# EAGLE board 20200724_Main_Board_V2_ForOrdering (EAGLE 7.7.0), part 1 of 3
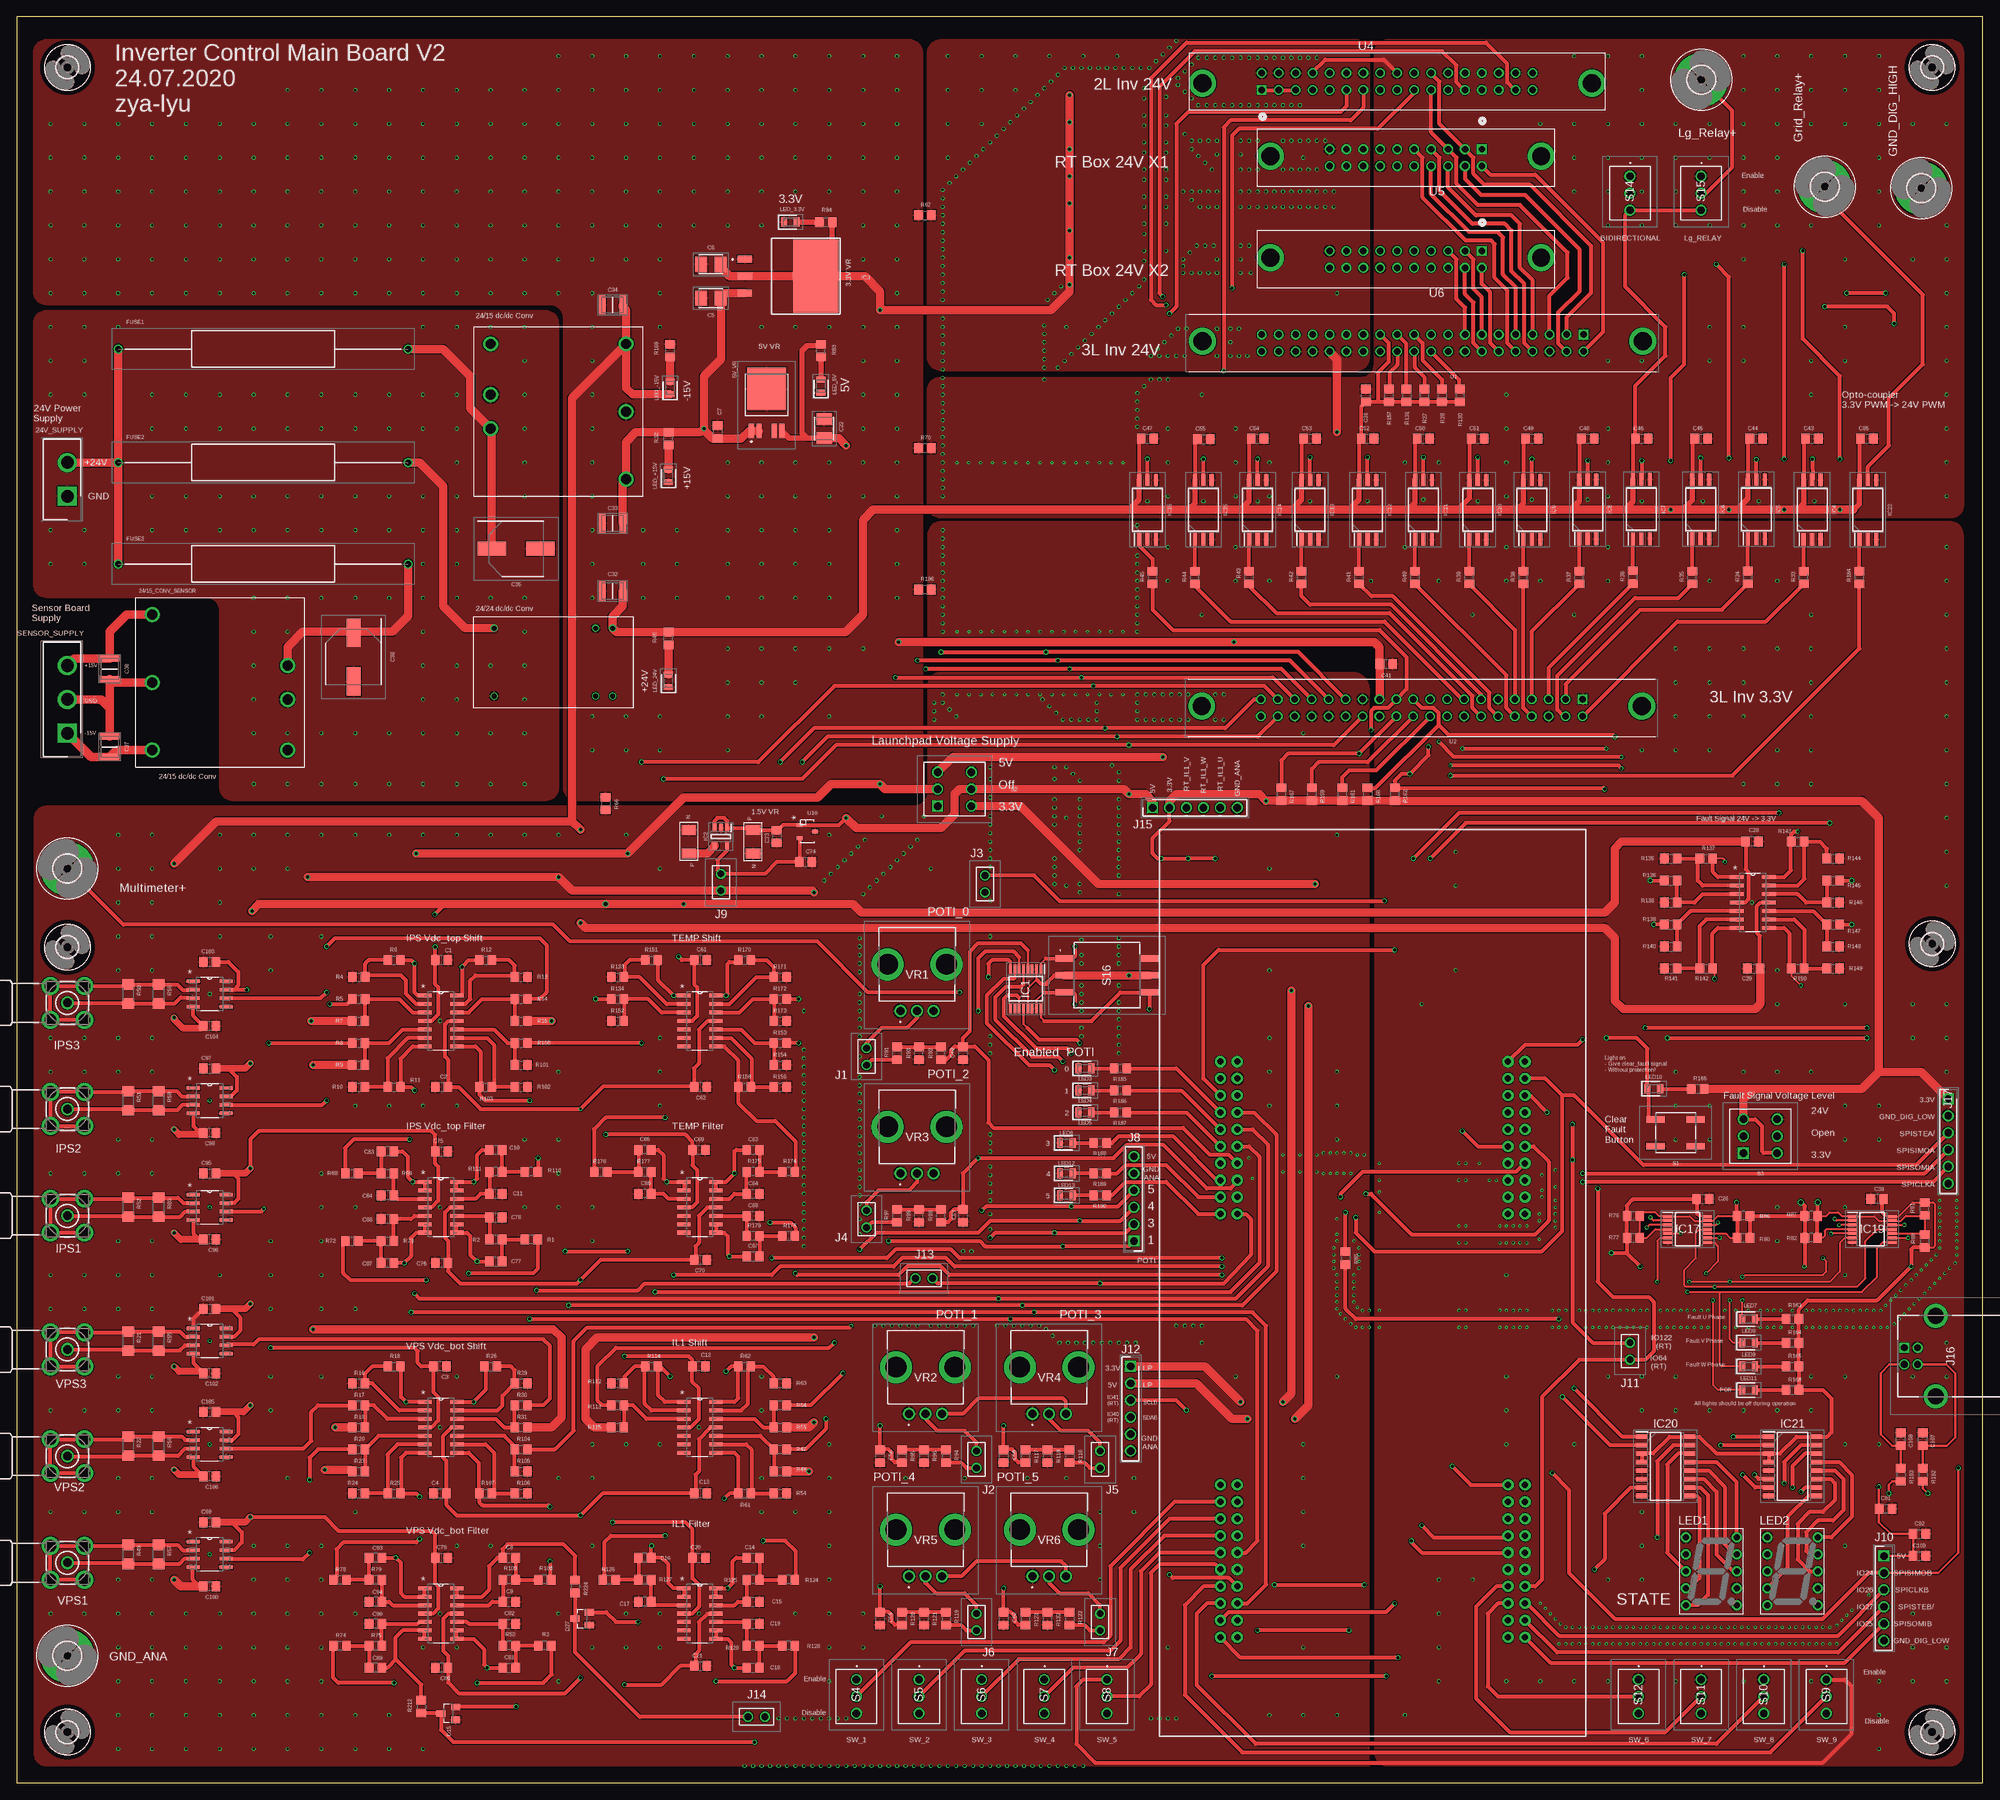
[diagram p10: board, top side]
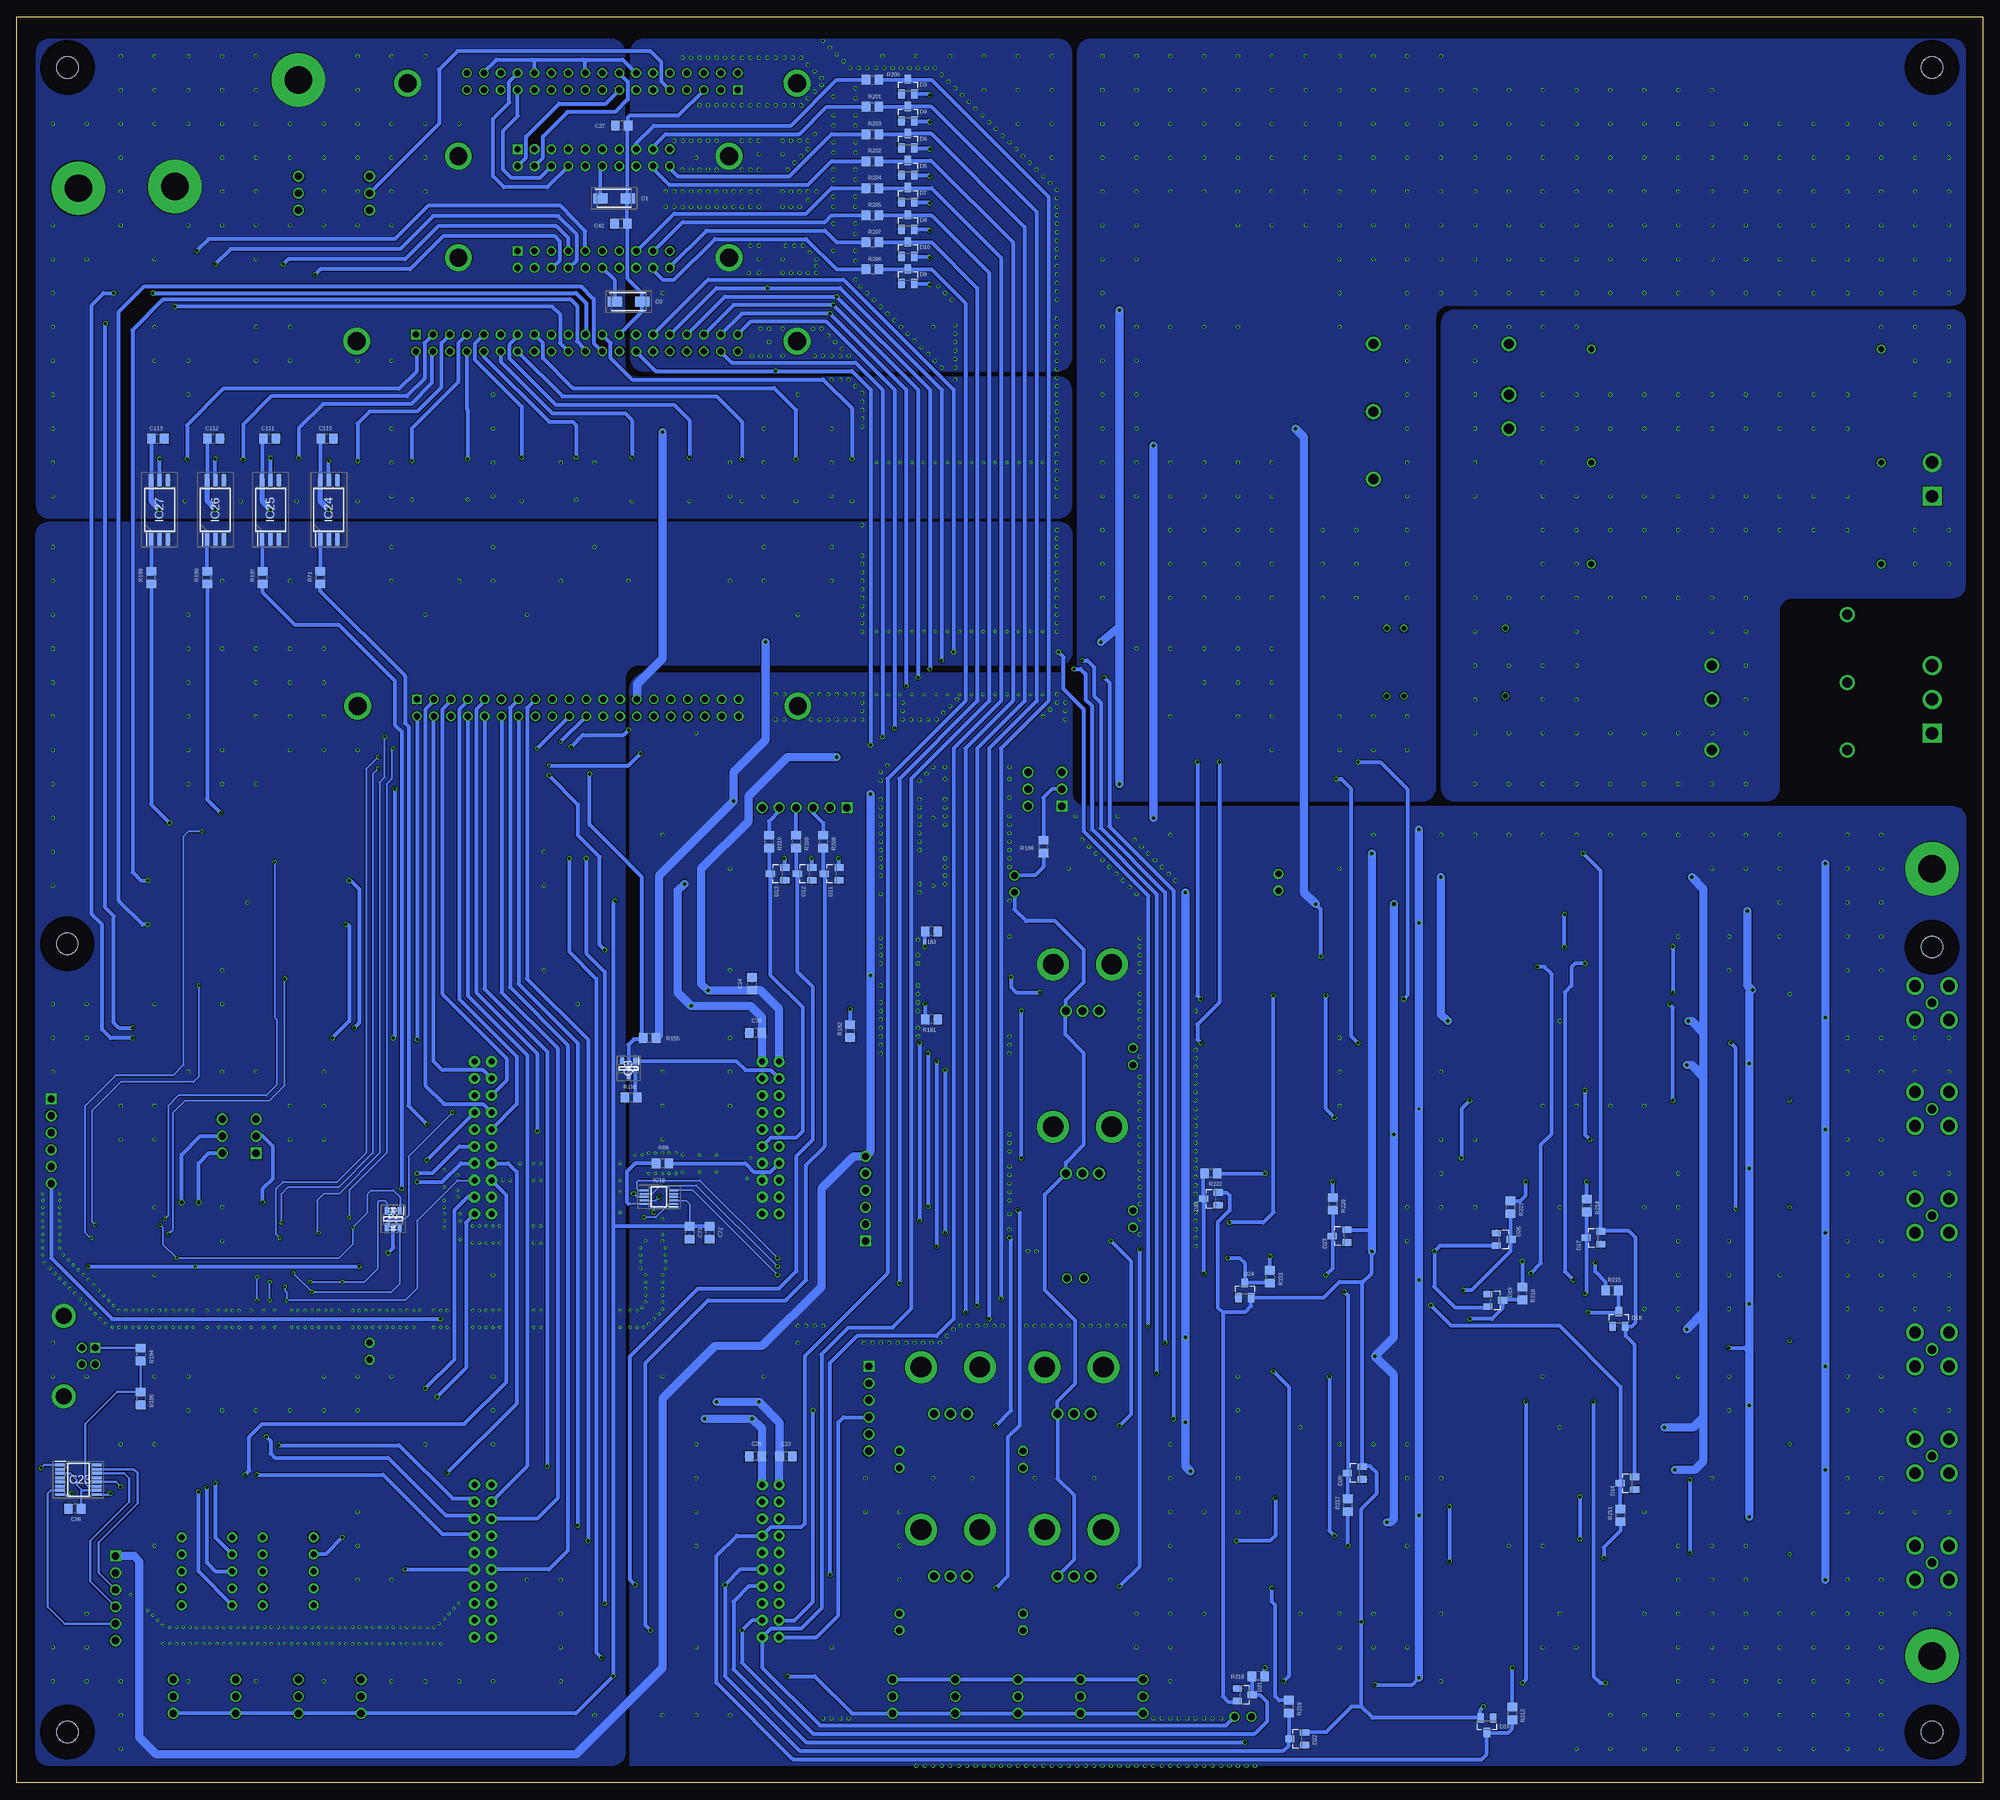
[diagram p11: board, bottom side, seen from below]

Size 295 x 265 mm. Coordinates in mm from the lower left corner, seen from the top.
Outline: 0,0 295,0 295,265 0,265 0,0
Copper layers (1*16): Top 0.018mm / dielectric 1.55mm / Bottom 0.018mm
Design rules "Multi-CB_2L_125um-Tracks_OL35um *": minimum track width 0.125mm, minimum drill 0.2mm, track to track 0.125mm, track to pad 0.125mm, pad to pad 0.125mm, via to via 0.125mm, smd to smd 0mil, copper to edge 0.2mm, drill to drill 0.2mm, minimum pad ring 0.125mm, minimum via ring 0.125mm, stop-mask expansion 2mil, vias tented up to drill 0.45mm, thermal gap 0.2mm

## Footprints (pad centres in the part's own frame; a part is rotated, then mirrored left to right if it is on the bottom)
BTS6143D = smd 0.8 x 2.2: 1 -2.28,-3.4; 2 -1.14,-3.4; 4 1.14,-3.4; 5 2.28,-3.4 | smd 5.8 x 6.4: 3 0,2.9
CUI_24V/15V_DCDC_CONV = drill 1.499: P$1 15.24,22.86; P$2 10.16,22.86; P$3 2.54,2.54; P$4 12.7,2.54; P$5 22.86,2.54; P$6 22.86,22.86
TRACO_24V/24V_DCDC_CONV = drill 0.7: P$1 3.048,1.778; P$7 18.288,1.778; P$8 20.828,1.778; P$9 20.828,11.938; P$10 18.288,11.938; P$16 3.048,11.938
SHDR2W120P0X508_1X2_1208X1200X = drill 1.9 pad 2.85 square: 1 0,0 | drill 1.9 pad 2.85: 2 5.08,0
C0805 = smd 1.3 x 1.5: 1 -0.95,0; 2 0.95,0
DIONM3528X210N = smd 1.8 x 2.3: 1 -1.45,0; 2 1.45,0
CAPC3225X230N = smd 0.92 x 2.82: 1 -1.54,0; 2 1.54,0
CAPAE830X1050N = smd 4.25 x 2.1: 1 -3.65,0; 2 3.65,0
DIOM5127X229N = smd 2.2 x 1.55: 1 -2.05,0; 2 2.05,0
SOT23 = smd 1 x 1.4: 1 -0.95,-1.1; 2 0.95,-1.1; 3 0,1.1
RESAD4350W70L2150D550 = drill 0.9 pad 1.35: 1 0,0; 2 43.5,0
3,2 = hole 3.2: 0,0
4,1-PAD = drill 4.1 pad 8: B4,1 0,0
SOP65P640X120-16N = smd 1.475 x 0.45: 1 -2.938,2.275; 2 -2.938,1.625; 3 -2.938,0.975; 4 -2.938,0.325; 5 -2.938,-0.325; 6 -2.938,-0.975; 7 -2.938,-1.625; 8 -2.938,-2.275; 9 2.938,-2.275; 10 2.938,-1.625; 11 2.938,-0.975; 12 2.938,-0.325; 13 2.938,0.325; 14 2.938,0.975; 15 2.938,1.625; 16 2.938,2.275
SOT95P280X145-5N = smd 1.2 x 0.6: 1 -1.25,0.95; 2 -1.25,0; 3 -1.25,-0.95; 4 1.25,-0.95; 5 1.25,0.95
KTT0003B = smd 2.16 x 1.07: 1 12.67,-2.54; 2 12.67,0; 3 12.67,2.54 | smd 6.858 x 10.922: TAB 2.032,0
SOIC127P970X378-6N = smd 1.85 x 0.65: 1 -4.45,1.27; 2 -4.45,0; 3 -4.45,-1.27; 4 4.45,-1.27; 5 4.45,0; 6 4.45,1.27
SOP65P640X110-14N = smd 1.475 x 0.45: 1 -2.938,1.95; 2 -2.938,1.3; 3 -2.938,0.65; 4 -2.938,0; 5 -2.938,-0.65; 6 -2.938,-1.3; 7 -2.938,-1.95; 8 2.938,-1.95; 9 2.938,-1.3; 10 2.938,-0.65; 11 2.938,0; 12 2.938,0.65; 13 2.938,1.3; 14 2.938,1.95
SOP50P490X110-10N = smd 1.4 x 0.3: 1 -2.2,1; 2 -2.2,0.5; 3 -2.2,0; 4 -2.2,-0.5; 5 -2.2,-1; 6 2.2,-1; 7 2.2,-0.5; 8 2.2,0; 9 2.2,0.5; 10 2.2,1
SOIC127P780X200-16N = smd 1.825 x 0.7: 1 -3.562,4.445; 2 -3.562,3.175; 3 -3.562,1.905; 4 -3.562,0.635; 5 -3.562,-0.635; 6 -3.562,-1.905; 7 -3.562,-3.175; 8 -3.562,-4.445; 9 3.562,-4.445; 10 3.562,-3.175; 11 3.562,-1.905; 12 3.562,-0.635; 13 3.562,0.635; 14 3.562,1.905; 15 3.562,3.175; 16 3.562,4.445
SOP64P599X175-16N = smd 1.526 x 0.435: 1 -2.712,2.222; 2 -2.712,1.588; 3 -2.712,0.952; 4 -2.712,0.318; 5 -2.712,-0.318; 6 -2.712,-0.952; 7 -2.712,-1.588; 8 -2.712,-2.222; 9 2.712,-2.222; 10 2.712,-1.588; 11 2.712,-0.952; 12 2.712,-0.318; 13 2.712,0.318; 14 2.712,0.952; 15 2.712,1.588; 16 2.712,2.222
SOT95P280X145-6N = smd 1.2 x 0.6: 1 -1.25,0.95; 2 -1.25,0; 3 -1.25,-0.95; 4 1.25,-0.95; 5 1.25,0; 6 1.25,0.95
BU-SMA-H = drill 1.27: 1 0,0 | drill 1.778: 2 -2.55,2.55; 3 2.55,2.55; 4 2.55,-2.55; 5 -2.55,-2.55
M209730245 = drill 1 pad 1.5: 1 0,0; 2 2.54,0
HDRV6W64P0X254_1X6_1524X254X86 = drill 1.1 pad 1.65 square: 1 0,0 | drill 1.1 pad 1.65: 2 2.54,0; 3 5.08,0; 4 7.62,0; 5 10.16,0; 6 12.7,0
617290021BLF = drill 1 pad 1.5 square: 1 0,0 | drill 1 pad 1.5: 2 -2.5,0; 3 -2.5,-2; 4 0,-2 | drill 2.38 pad 3.57: MH1 4.77,-4.71; MH2 -7.27,-4.71
LA-401 = drill 0.9 pad 1.5: 1 -3.81,5.08; 2 -3.81,2.54; 3 -3.81,0; 4 -3.81,-2.54; 5 -3.81,-5.08; 6 3.81,-5.08; 7 3.81,-2.54; 8 3.81,0; 9 3.81,2.54; 10 3.81,5.08
LEDC2012X75N = smd 0.95 x 1.45: 1 -0.95,0; 2 0.95,0
LEDC2012X85N = smd 0.9 x 1.4: 1 -0.95,0; 2 0.95,0
SOT95P230X110-3N = smd 1.05 x 0.6: 1 -1.1,0.95; 2 -1.1,-0.95; 3 1.1,0
R0805 = smd 1.3 x 1.5: 1 -0.95,0; 2 0.95,0
R1206 = smd 1.6 x 1.803: 1 -1.422,0; 2 1.422,0
EVPBF6C1A000 = smd 2.75 x 1: A1 3,-2; A2 -3,-2; B1 3,2; B2 -3,2
200MDP1T2B1M2QEH = drill 1.12 pad 1.68 square: 1 0,0 | drill 1.12 pad 1.68: 2 0,2.54; 3 0,5.08; 4 5.08,0; 5 5.08,2.54; 6 5.08,5.08
200MSP1T1B1M2QEH = drill 1.09 pad 1.635: 1 0,0; 2 2.54,0; 3 5.08,0
A6RS162RSP = smd 1 x 2.7: 1 -2.54,-6.35; 2 2.54,6.35; 4 2.54,-6.35; 8 -2.54,6.35; C1 0,-6.35; C2 0,6.35
SHDR3W120P0X508_1X3_1716X1200X = drill 1.9 pad 2.85 square: 1 0,0 | drill 1.9 pad 2.85: 2 5.08,0; 3 10.16,0
TYCO_5499206-9 = drill 0.965 pad 1.448 square: 1 -48.26,-2.54 | drill 0.965 pad 1.448: 2 -48.26,0; 3 -45.72,-2.54; 4 -45.72,0; 5 -43.18,-2.54; 6 -43.18,0; 7 -40.64,-2.54; 8 -40.64,0; 9 -38.1,-2.54; 10 -38.1,0; 11 -35.56,-2.54; 12 -35.56,0; 13 -33.02,-2.54; 14 -33.02,0; 15 -30.48,-2.54; 16 -30.48,0; 17 -27.94,-2.54; 18 -27.94,0; 19 -25.4,-2.54; 20 -25.4,0; 21 -22.86,-2.54; 22 -22.86,0; 23 -20.32,-2.54; 24 -20.32,0; 25 -17.78,-2.54; 26 -17.78,0; 27 -15.24,-2.54; 28 -15.24,0; 29 -12.7,-2.54; 30 -12.7,0; 31 -10.16,-2.54; 32 -10.16,0; 33 -7.62,-2.54; 34 -7.62,0; 35 -5.08,-2.54; 36 -5.08,0; 37 -2.54,-2.54; 38 -2.54,0; 39 0,-2.54; 40 0,0 | drill 2.692 pad 4.039: 41 -57.15,-1.524; 42 8.89,-1.524
TYCO_5499206-8 = drill 0.965 pad 1.448 square: 1 -40.64,-2.54 | drill 0.965 pad 1.448: 2 -40.64,0; 3 -38.1,-2.54; 4 -38.1,0; 5 -35.56,-2.54; 6 -35.56,0; 7 -33.02,-2.54; 8 -33.02,0; 9 -30.48,-2.54; 10 -30.48,0; 11 -27.94,-2.54; 12 -27.94,0; 13 -25.4,-2.54; 14 -25.4,0; 15 -22.86,-2.54; 16 -22.86,0; 17 -20.32,-2.54; 18 -20.32,0; 19 -17.78,-2.54; 20 -17.78,0; 21 -15.24,-2.54; 22 -15.24,0; 23 -12.7,-2.54; 24 -12.7,0; 25 -10.16,-2.54; 26 -10.16,0; 27 -7.62,-2.54; 28 -7.62,0; 29 -5.08,-2.54; 30 -5.08,0; 31 -2.54,-2.54; 32 -2.54,0; 33 0,-2.54; 34 0,0 | drill 2.692 pad 4.039: 35 -49.53,-1.524; 36 8.89,-1.524
TYCO_5499206-4 = drill 0.965 pad 1.448 square: 1 -22.86,-2.54 | drill 0.965 pad 1.448: 2 -22.86,0; 3 -20.32,-2.54; 4 -20.32,0; 5 -17.78,-2.54; 6 -17.78,0; 7 -15.24,-2.54; 8 -15.24,0; 9 -12.7,-2.54; 10 -12.7,0; 11 -10.16,-2.54; 12 -10.16,0; 13 -7.62,-2.54; 14 -7.62,0; 15 -5.08,-2.54; 16 -5.08,0; 17 -2.54,-2.54; 18 -2.54,0; 19 0,-2.54; 20 0,0 | drill 2.692 pad 4.039: 21 -31.75,-1.524; 22 8.89,-1.524
TL084/SO_OP_LIB = smd 2.057 x 0.61: 1 -2.261,3.81; 2 -2.261,2.54; 3 -2.261,1.27; 4 -2.261,0; 5 -2.261,-1.27; 6 -2.261,-2.54; 7 -2.261,-3.81; 8 2.54,-3.81; 9 2.54,-2.54; 10 2.54,-1.27; 11 2.54,0; 12 2.54,1.27; 13 2.54,2.54; 14 2.54,3.81
SOT23-3 = smd 0.6 x 0.9: 1 0.32,-1.15; 2 2.22,-1.15; 3 1.27,1.15
TANTALUM_C_1UF_KEM = smd 1.5 x 2.2: N 1.75,0; P -1.75,0
LAUNCHPAD28379 = drill 0.9 pad 1.676: P$1 -22.86,43.18; P$2 -22.86,40.64; P$3 -22.86,38.1; P$4 -22.86,35.56; P$5 -22.86,33.02; P$6 -22.86,30.48; P$7 -22.86,27.94; P$8 -22.86,25.4; P$9 -22.86,22.86; P$10 -22.86,20.32; P$11 22.86,20.32; P$12 22.86,22.86; P$13 22.86,25.4; P$14 22.86,27.94; P$15 22.86,30.48; P$16 22.86,33.02; P$17 22.86,35.56; P$18 22.86,38.1; P$19 22.86,40.64; P$20 22.86,43.18; P$21 -20.32,43.18; P$22 -20.32,40.64; P$23 -20.32,38.1; P$24 -20.32,35.56; P$25 -20.32,33.02; P$26 -20.32,30.48; P$27 -20.32,27.94; P$28 -20.32,25.4; P$29 -20.32,22.86; P$30 -20.32,20.32; P$31 20.32,20.32; P$32 20.32,22.86; P$33 20.32,25.4; P$34 20.32,27.94; P$35 20.32,30.48; P$36 20.32,33.02; P$37 20.32,35.56; P$38 20.32,38.1; P$39 20.32,40.64; P$40 20.32,43.18; P$41 -22.86,-20.32; P$42 -22.86,-22.86; P$43 -22.86,-25.4; P$44 -22.86,-27.94; P$45 -22.86,-30.48; P$46 -22.86,-33.02; P$47 -22.86,-35.56; P$48 -22.86,-38.1; P$49 -22.86,-40.64; P$50 -22.86,-43.18; P$51 22.86,-43.18; P$52 22.86,-40.64; P$53 22.86,-38.1; P$54 22.86,-35.56; P$55 22.86,-33.02; P$56 22.86,-30.48; P$57 22.86,-27.94; P$58 22.86,-25.4; P$59 22.86,-22.86; P$60 22.86,-20.32; P$61 -20.32,-20.32; P$62 -20.32,-22.86; P$63 -20.32,-25.4; P$64 -20.32,-27.94; P$65 -20.32,-30.48; P$66 -20.32,-33.02; P$67 -20.32,-35.56; P$68 -20.32,-38.1; P$69 -20.32,-40.64; P$70 -20.32,-43.18; P$71 20.32,-43.18; P$72 20.32,-40.64; P$73 20.32,-38.1; P$74 20.32,-35.56; P$75 20.32,-33.02; P$76 20.32,-30.48; P$77 20.32,-27.94; P$78 20.32,-25.4; P$79 20.32,-22.86; P$80 20.32,-20.32
AD629_DIFFA_LIB = smd 1.981 x 0.559: 1 -2.464,1.905; 2 -2.464,0.635; 3 -2.464,-0.635; 4 -2.464,-1.905; 5 2.464,-1.905; 6 2.464,-0.635; 7 2.464,0.635; 8 2.464,1.905
PTV09A4020FB503 = drill 1.2 pad 1.8: 1 0,0; 2 2.5,0; 3 5,0 | drill 3.124 pad 4.8: MH1 -1.9,7; MH2 6.9,7

## Placement (x,y rotation side)
5V_VR  TLS850B0TEV50ATMA1  [BTS6143D]  112.52,206.25 0 top
24/15_CONV  CUI_24V_15V_DC/DC_CONV  [CUI_24V/15V_DCDC_CONV]  93.98,193.04 90 top
24/15_CONV_SENSOR  CUI_24V_15V_DC/DC_CONV  [CUI_24V/15V_DCDC_CONV]  17.78,177.8 270 top
24/24_CONV  TRACO_24V_24V_DC/DC_CONV  [TRACO_24V/24V_DCDC_CONV]  68.58,161.29 0 top
24V_SUPPLY  1757242  [SHDR2W120P0X508_1X2_1208X1200X]  7.62,193.04 90 top
C1  0.1u  [C0805]  63.75,123.44 180 top
C2  0.1u  [C0805]  63.75,104.39 0 top
C3  0.1u  [C0805]  63.5,62.48 180 top
C4  0.1u  [C0805]  63.5,43.43 0 top
C5  TPSB106K025T1800  [DIONM3528X210N]  104.14,222.76 180 top
C6  TPSB106K025T1800  [DIONM3528X210N]  104.14,227.84 180 top
C7  100n  [C0805]  105.16,202.69 270 top
C8  2n  [C0805]  73.91,33.78 0 top
C9  1n  [C0805]  73.91,27.18 0 top
C10  2n  [C0805]  71.88,95 0 top
C11  1n  [C0805]  71.88,88.39 0 top
C12  0.1u  [C0805]  102.36,62.48 180 top
C13  0.1u  [C0805]  102.62,43.43 180 top
C14  2n  [C0805]  110.49,33.78 0 top
C15  1n  [C0805]  110.49,27.18 0 top
C16  2n  [C0805]  94.23,33.78 180 top
C17  1n  [C0805]  94.23,27.18 180 top
C18  2n  [C0805]  110.49,17.27 0 top
C19  1n  [C0805]  110.49,23.88 0 top
C20  0.1u  [C0805]  102.36,33.78 0 top
C21  0.1u  [C0805]  102.62,17.53 0 top
C22  TPSB106K025T1800  [DIONM3528X210N]  121.16,203.2 90 top
C23  0.1u  [C0805]  179.58,49.02 0 bottom
C24  0.1u  [C0805]  184.66,119.89 90 bottom
C25  0.1u  [C0805]  184.15,49.02 180 bottom
C26  0.1u  [C0805]  252.98,87.63 0 top
C27  0.1u  [C0805]  204.22,248.67 180 bottom
C28  0.1u  [C0805]  260.35,141.22 180 top
C29  0.1u  [C0805]  260.6,122.17 0 top
C30  0.1u  [C0805]  184.15,112.52 180 bottom
C31  0.1u  [C0805]  202.44,208.15 90 top
C32  10uF Ceramic  [CAPC3225X230N]  89.41,178.82 0 top
C33  10uF Ceramic  [CAPC3225X230N]  89.41,188.98 0 top
C34  10uF Ceramic  [CAPC3225X230N]  89.41,221.74 180 top
C35  100uF 50V EEV107M050S9MAA  [CAPAE830X1050N]  74.93,185.17 0 top
C36  10uF Ceramic  [CAPC3225X230N]  13.97,167.13 90 top
C37  10uF Ceramic  [CAPC3225X230N]  13.97,155.45 90 top
C38  100uF 50V EEV107M050S9MAA  [CAPAE830X1050N]  50.55,168.91 270 top
C39  0.1u  [C0805]  279.15,87.63 180 top
C40  0.1u  [C0805]  141.99,109.47 270 top
C41  0.1u  [C0805]  205.49,167.89 0 top
C42  0.1u  [C0805]  204.34,233.93 180 bottom
C43  0.1u  [C0805]  269.37,201.68 0 top
C44  0.1u  [C0805]  260.99,201.68 0 top
C45  0.1u  [C0805]  252.73,201.68 0 top
C46  0.1u  [C0805]  243.84,201.68 0 top
C47  0.1u  [C0805]  169.67,201.68 0 top
C48  0.1u  [C0805]  235.71,201.68 0 top
C49  0.1u  [C0805]  227.33,201.68 0 top
C50  0.1u  [C0805]  211.07,201.68 0 top
C51  0.1u  [C0805]  219.2,201.68 0 top
C52  0.1u  [C0805]  202.69,201.68 0 top
C53  0.1u  [C0805]  194.06,201.68 0 top
C54  0.1u  [C0805]  186.18,201.68 0 top
C55  0.1u  [C0805]  178.1,201.63 0 top
C56  0.1u  [C0805]  129.54,49.02 270 top
C57  0.1u  [C0805]  141.99,85.09 270 top
C58  0.1u  [C0805]  148.08,49.02 270 top
C59  0.1u  [C0805]  129.54,24.64 270 top
C60  0.1u  [C0805]  148.08,24.64 270 top
C61  0.1u  [C0805]  102.62,123.44 180 top
C62  0.1u  [C0805]  102.62,104.39 180 top
C63  2n  [C0805]  110.49,95 0 top
C64  1n  [C0805]  110.49,88.39 0 top
C65  2n  [C0805]  94.23,95 180 top
C66  1n  [C0805]  94.23,88.39 180 top
C67  2n  [C0805]  110.49,78.99 0 top
C68  1n  [C0805]  110.49,85.09 0 top
C69  0.1u  [C0805]  102.36,95 0 top
C70  0.1u  [C0805]  102.62,78.49 0 top
C71  0.1u  [C0805]  194.06,82.55 270 bottom
C72  1u  [C0805]  191.01,82.55 270 bottom
C73  1u  [C0805]  114.05,141.99 270 top
C74  1u  [C0805]  118.36,138.18 0 top
C75  0.1u  [C0805]  63.75,94.74 0 top
C76  0.1u  [C0805]  63.75,77.98 180 top
C77  2n  [C0805]  71.88,78.23 0 top
C78  1n  [C0805]  71.88,84.84 0 top
C79  0.1u  [C0805]  63.75,33.78 0 top
C80  0.1u  [C0805]  63.75,17.27 180 top
C81  2n  [C0805]  73.91,17.27 0 top
C82  1n  [C0805]  73.91,23.88 0 top
C83  2n  [C0805]  55.63,94.74 180 top
C84  1n  [C0805]  55.63,88.14 180 top
C85  0.1u  [C0805]  277.62,201.68 0 top
C86  0.1u  [C0805]  286.26,41.15 180 bottom
C87  2n  [C0805]  55.63,77.98 180 top
C88  1n  [C0805]  55.63,84.58 180 top
C89  2n  [C0805]  53.85,17.27 180 top
C90  1n  [C0805]  53.85,23.88 180 top
C91  0.1u  [C0805]  280.42,41.15 0 top
C92  4.7u  [C0805]  285.5,37.34 0 top
C93  2n  [C0805]  53.85,33.78 180 top
C94  1n  [C0805]  53.85,27.18 180 top
C95  0.1u  [C0805]  28.96,91.44 0 top
C96  0.1u  [C0805]  28.96,81.53 180 top
C97  0.1u  [C0805]  28.96,107.19 0 top
C98  0.1u  [C0805]  28.96,97.54 180 top
C99  0.1u  [C0805]  28.96,39.12 0 top
C100  0.1u  [C0805]  28.96,29.46 180 top
C101  0.1u  [C0805]  28.96,71.12 0 top
C102  0.1u  [C0805]  28.96,61.47 180 top
C103  0.1u  [C0805]  28.96,123.19 0 top
C104  0.1u  [C0805]  28.96,113.54 180 top
C105  0.1u  [C0805]  28.96,55.63 0 top
C106  0.1u  [C0805]  28.96,45.97 180 top
C107  47p  [C0805]  286,51.56 90 top
C108  47p  [C0805]  282.7,51.56 90 top
C109  0.1u  [C0805]  285.5,34.04 0 top
C110  0.1u  [C0805]  248.41,201.68 0 bottom
C111  0.1u  [C0805]  257.05,201.68 0 bottom
C112  0.1u  [C0805]  265.43,201.68 0 bottom
C113  0.1u  [C0805]  273.81,201.68 0 bottom
D1  RS1A-E3_5AT  [DIOM5127X229N]  205.36,237.74 0 bottom
D2  RS1A-E3_5AT  [DIOM5127X229N]  203.2,222.25 0 bottom
D3  BAS40-04  [SOT23]  161.29,254.51 0 bottom
D4  BAS40-04  [SOT23]  161.29,250.44 0 bottom
D5  BAS40-04  [SOT23]  161.29,242.32 0 bottom
D6  BAS40-04  [SOT23]  161.29,246.38 0 bottom
D7  BAS40-04  [SOT23]  161.29,238.25 0 bottom
D8  BAS40-04  [SOT23]  161.29,234.19 0 bottom
D9  BAS40-04  [SOT23]  161.29,226.06 0 bottom
D10  BAS40-04  [SOT23]  161.29,230.12 0 bottom
D11  BAS40-04  [SOT23]  172.72,136.4 90 bottom
D12  BAS40-04  [SOT23]  176.78,136.4 90 bottom
D13  BAS40-04  [SOT23]  180.85,136.4 90 bottom
D14  BAS40-04  [SOT23]  53.34,44.96 90 bottom
D15  BAS40-04  [SOT23]  64.77,10.41 90 top
D16  BAS40-04  [SOT23]  74.42,8.64 180 bottom
D17  BAS40-04  [SOT23]  58.42,81.79 90 bottom
D18  BAS40-04  [SOT23]  54.61,69.6 0 bottom
D19  BAS40-04  [SOT23]  73.15,72.39 270 bottom
D20  BAS40-04  [SOT23]  94.23,46.48 90 bottom
D21  BAS40-04  [SOT23]  110.74,13.21 270 bottom
D22  BAS40-04  [SOT23]  102.87,6.6 90 bottom
D23  BAS40-04  [SOT23]  96.52,82.04 90 bottom
D24  BAS40-04  [SOT23]  110.74,73.91 0 bottom
D25  BAS40-04  [SOT23]  115.82,87.63 90 bottom
D26  BAS40-04  [SOT23]  71.88,81.53 270 bottom
D27  BAS40-04  [SOT23]  84.84,24.64 90 top
FUSE1  0213001.MXP  [RESAD4350W70L2150D550]  15.24,215.14 0 top
FUSE2  0213001.MXP  [RESAD4350W70L2150D550]  15.24,198.12 0 top
FUSE3  0213001.MXP  [RESAD4350W70L2150D550]  15.24,182.88 0 top
H1  MOUNT-HOLE3.2  [3,2]  7.62,7.62 0 top
H2  MOUNT-HOLE3.2  [3,2]  287.38,7.62 0 top
H3  MOUNT-HOLE3.2  [3,2]  7.62,257.38 0 top
H4  MOUNT-HOLE3.2  [3,2]  287.38,257.38 0 top
H5  MOUNT-PAD-ROUND4.1  [4,1-PAD]  285.75,239.27 90 top
H6  MOUNT-PAD-ROUND4.1  [4,1-PAD]  252.73,255.52 0 top
H7  MOUNT-PAD-ROUND4.1  [4,1-PAD]  271.27,239.52 90 top
H8  MOUNT-PAD-ROUND4.1  [4,1-PAD]  7.62,137.16 90 top
H9  MOUNT-PAD-ROUND4.1  [4,1-PAD]  7.62,19.05 90 top
H10  MOUNT-HOLE3.2  [3,2]  7.62,125.39 0 top
H11  MOUNT-HOLE3.2  [3,2]  287.4,125.9 0 top
IC1  ADG708BRUZ  [SOP65P640X120-16N]  151.38,119.13 270 top
IC2  LP3992IMFX-1.5_NOPB  [SOT95P280X145-5N]  105.66,141.99 270 top
IC3  LM1086ISX-3.3_NOPB  [KTT0003B]  121.92,226.06 180 top
IC4  FOD8480  [SOIC127P970X378-6N]  269.39,191.03 90 top
IC5  FOD8480  [SOIC127P970X378-6N]  261.01,191.08 90 top
IC6  FOD8480  [SOIC127P970X378-6N]  252.65,191.08 90 top
IC7  FOD8480  [SOIC127P970X378-6N]  243.76,191.11 90 top
IC8  FOD8480  [SOIC127P970X378-6N]  235.71,191.08 90 top
IC9  FOD8480  [SOIC127P970X378-6N]  227.33,191.01 90 top
IC10  FOD8480  [SOIC127P970X378-6N]  219.2,191.01 90 top
IC11  FOD8480  [SOIC127P970X378-6N]  211.07,191.01 90 top
IC12  FOD8480  [SOIC127P970X378-6N]  202.69,191.01 90 top
IC13  FOD8480  [SOIC127P970X378-6N]  194.06,191.01 90 top
IC14  FOD8480  [SOIC127P970X378-6N]  186.18,191.01 90 top
IC15  FOD8480  [SOIC127P970X378-6N]  178.05,191.01 90 top
IC16  FOD8480  [SOIC127P970X378-6N]  169.67,191.01 90 top
IC17  74CBTLV3125PW-Q10J  [SOP65P640X110-14N]  250.7,83.06 0 top
IC18  ADC124S101CIMM_NOPB  [SOP50P490X110-10N]  198.63,87.88 180 bottom
IC19  74CBTLV3125PW-Q10J  [SOP65P640X110-14N]  278.38,83.06 0 top
IC20  CD4511BNSR  [SOIC127P780X200-16N]  247.4,47.5 0 top
IC21  CD4511BNSR  [SOIC127P780X200-16N]  266.45,47.5 0 top
IC22  FOD8480  [SOIC127P970X378-6N]  277.75,191.01 90 top
IC23  FT220XS-R  [SOP64P599X175-16N]  285.75,45.47 0 bottom
IC24  FOD8480  [SOIC127P970X378-6N]  248.16,191.01 90 bottom
IC25  FOD8480  [SOIC127P970X378-6N]  256.92,191.01 90 bottom
IC26  FOD8480  [SOIC127P970X378-6N]  265.18,191.01 90 bottom
IC27  FOD8480  [SOIC127P970X378-6N]  273.56,191.01 90 bottom
IC28  SN74LVC1G11DBVR  [SOT95P280X145-6N]  238.51,84.58 270 bottom
IPS1  BU-SMA-H  [BU-SMA-H]  7.62,85.09 180 top
IPS2  BU-SMA-H  [BU-SMA-H]  7.62,101.09 180 top
IPS3  BU-SMA-H  [BU-SMA-H]  7.62,117.02 180 top
J1  M20-9730245  [M209730245]  127.51,107.7 90 top
J2  M20-9730245  [M209730245]  144.02,47.24 90 top
J3  M20-9730245  [M209730245]  145.29,133.6 90 top
J4  M20-9730245  [M209730245]  127.51,83.31 90 top
J5  M20-9730245  [M209730245]  162.56,47.24 90 top
J6  M20-9730245  [M209730245]  144.02,22.86 90 top
J7  M20-9730245  [M209730245]  162.56,22.86 90 top
J8  M20-9990645  [HDRV6W64P0X254_1X6_1524X254X86]  167.64,81.28 90 top
J9  M20-9730245  [M209730245]  105.66,133.86 90 top
J10  M20-9990645  [HDRV6W64P0X254_1X6_1524X254X86]  280.16,34.04 270 top
J11  M20-9730245  [M209730245]  242.06,66.04 270 top
J12  M20-9990645  [HDRV6W64P0X254_1X6_1524X254X86]  167.13,62.48 270 top
J13  M20-9730245  [M209730245]  137.41,75.69 180 top
J14  M20-9730245  [M209730245]  112.27,9.91 180 top
J15  M20-9990645  [HDRV6W64P0X254_1X6_1524X254X86]  170.43,146.3 0 top
J16  61729-0021BLF  [617290021BLF]  283.21,65.28 90 top
J17  M20-9990645  [HDRV6W64P0X254_1X6_1524X254X86]  289.81,102.62 270 top
LED1  LA-401VN  [LA-401]  254.25,31.75 0 top
LED2  LA-401VN  [LA-401]  266.45,31.75 0 top
LED3  APT2012LSECK_J3-PRV  [LEDC2012X75N]  160.27,107.19 0 top
LED4  APT2012LSECK_J3-PRV  [LEDC2012X75N]  160.27,103.89 0 top
LED5  APT2012LSECK_J3-PRV  [LEDC2012X75N]  160.27,100.58 0 top
LED6  APT2012LSECK_J3-PRV  [LEDC2012X75N]  157.48,96.01 0 top
LED7  APT2012LSECK_J3-PRV  [LEDC2012X75N]  259.84,69.6 0 top
LED8  APT2012LSECK_J3-PRV  [LEDC2012X75N]  259.84,66.04 0 top
LED9  APT2012LSECK_J3-PRV  [LEDC2012X75N]  259.84,62.48 0 top
LED10  APT2012LSECK_J3-PRV  [LEDC2012X75N]  245.62,104.14 0 top
LED11  APT2012LSECK_J3-PRV  [LEDC2012X75N]  259.84,58.93 0 top
LED12  APT2012LSECK_J3-PRV  [LEDC2012X75N]  157.48,91.44 0 top
LED13  APT2012LSECK_J3-PRV  [LEDC2012X75N]  157.48,88.14 0 top
LED_3.3V  Green LED APT2012LZGCK  [LEDC2012X85N]  116.08,234.19 0 top
LED_5V  Green LED APT2012LZGCK  [LEDC2012X85N]  120.65,209.55 90 top
LED_24V  Green LED APT2012LZGCK  [LEDC2012X85N]  97.79,165.35 90 top
LED_+15V  Green LED APT2012LZGCK  [LEDC2012X85N]  97.79,196.09 90 top
LED_-15V  Green LED APT2012LZGCK  [LEDC2012X85N]  98.04,209.3 90 top
Q3  BSS138BK-215  [SOT95P230X110-3N]  203.2,107.19 270 bottom
R1  2.81k  [R0805]  77.22,81.53 180 top
R2  2.81k  [R0805]  71.88,81.53 180 top
R3  2.81k  [R0805]  79.25,20.57 180 top
R4  100k  [R0805]  51.33,120.9 0 top
R5  100k  [R0805]  51.33,117.6 0 top
R6  26.1k  [R0805]  56.64,123.44 0 top
R7  26.1k  [R0805]  51.31,114.3 0 top
R8  100k  [R0805]  51.31,111 0 top
R9  26.1k  [R0805]  51.31,107.7 0 top
R10  100k  [R0805]  51.31,104.39 0 top
R11  26.1k  [R0805]  56.64,104.39 0 top
R12  26.1k  [R0805]  70.36,123.44 0 top
R13  100k  [R0805]  75.69,120.9 0 top
R14  100k  [R0805]  75.69,117.6 0 top
R15  26.1k  [R0805]  75.69,114.3 0 top
R16  100k  [R0805]  51.31,59.94 0 top
R17  100k  [R0805]  51.31,56.64 0 top
R18  24.6k  [R0805]  56.64,62.48 0 top
R19  24.6k  [R0805]  51.31,53.34 0 top
R20  100k  [R0805]  51.31,50.04 0 top
R21  424  [R1206]  16.76,66.29 270 top
R22  424  [R1206]  16.76,50.55 270 top
R23  24.6k  [R0805]  51.31,46.74 0 top
R24  100k  [R0805]  51.31,43.43 0 top
R25  24.6k  [R0805]  56.64,43.43 0 top
R26  24.6k  [R0805]  71.12,62.48 0 top
R27  1k  [R0805]  211.2,208.15 270 top
R28  1k  [R0805]  213.87,208.15 270 top
R29  100k  [R0805]  75.69,59.94 0 top
R30  100k  [R0805]  75.69,56.64 0 top
R31  24.6k  [R0805]  75.69,53.34 0 top
R32  2k  [R0805]  97.79,201.68 90 top
R33  250  [R0805]  268.12,180.85 90 top
R34  250  [R0805]  259.74,180.87 90 top
R35  250  [R0805]  251.38,180.85 90 top
R36  250  [R0805]  242.49,180.9 90 top
R37  250  [R0805]  234.44,180.85 90 top
R38  250  [R0805]  226.06,180.85 90 top
R39  250  [R0805]  217.93,180.85 90 top
R40  250  [R0805]  209.8,180.85 90 top
R41  250  [R0805]  201.42,180.85 90 top
R42  250  [R0805]  192.79,180.85 90 top
R43  250  [R0805]  184.91,180.85 90 top
R44  250  [R0805]  176.78,180.85 90 top
R45  250  [R0805]  170.43,180.85 90 top
R46  4k  [R0805]  97.79,171.7 90 top
R47  100k  [R0805]  114.55,50.04 0 top
R48  15k  [R0805]  114.55,46.74 0 top
R49  424  [R1206]  16.76,34.29 270 top
R50  500  [R1206]  16.76,118.36 270 top
R51  500  [R1206]  16.76,102.36 270 top
R52  500  [R1206]  16.76,86.36 270 top
R53  2.81k  [R0805]  73.91,20.57 180 top
R54  100k  [R0805]  114.55,43.43 0 top
R55  424  [R1206]  21.34,66.29 270 top
R56  424  [R1206]  21.34,50.55 270 top
R57  424  [R1206]  21.34,34.29 270 top
R58  500  [R1206]  21.34,118.36 270 top
R59  500  [R1206]  21.34,102.36 270 top
R60  500  [R1206]  21.34,86.36 270 top
R61  15k  [R0805]  109.22,43.43 0 top
R62  15k  [R0805]  109.22,62.48 0 top
R63  100k  [R0805]  114.55,59.94 0 top
R64  100k  [R0805]  114.55,56.64 0 top
R65  15k  [R0805]  114.55,53.34 0 top
R66  0  [R0805]  88.39,146.94 270 top
R67  0  [R0805]  136.27,235.2 0 top
R68  2.81k  [R0805]  50.29,91.44 0 top
R69  2.81k  [R0805]  55.63,91.44 0 top
R70  0  [R0805]  136.27,200.28 0 top
R71  250  [R0805]  249.43,180.85 90 bottom
R72  2.81k  [R0805]  50.29,81.28 0 top
R73  2.81k  [R0805]  55.63,81.28 0 top
R74  2.81k  [R0805]  48.51,20.57 0 top
R75  2.81k  [R0805]  53.85,20.57 0 top
R76  10k  [R0805]  242.57,85.09 0 top
R77  10k  [R0805]  242.57,81.79 0 top
R78  2.81k  [R0805]  48.51,30.48 0 top
R79  2.81k  [R0805]  53.85,30.48 0 top
R80  10k  [R0805]  259.08,81.79 0 top
R81  10k  [R0805]  286.26,86.11 90 top
R82  10k  [R0805]  269.24,81.79 180 top
R83  460  [R0805]  120.65,214.88 90 top
R84  100  [R0805]  121.41,234.19 0 top
R85  0  [R0805]  199.39,78.74 270 top
R86  10k  [R0805]  259.08,85.09 180 top
R87  10k  [R0805]  269.24,85.09 180 top
R88  10k  [R0805]  286.26,81.28 270 top
R89  0  [R0805]  198.12,92.96 0 bottom
R91  10k  [R0805]  132.08,109.47 270 top
R92  1k  [R0805]  138.68,109.47 90 top
R93  10k  [R0805]  135.38,109.47 90 top
R94  10k  [R0805]  139.45,49.02 270 top
R95  10k  [R0805]  132.84,49.02 90 top
R96  10k  [R0805]  136.14,49.02 90 top
R97  10k  [R0805]  132.08,85.09 270 top
R98  10k  [R0805]  138.68,85.09 90 top
R99  10k  [R0805]  135.38,85.09 90 top
R100  100k  [R0805]  75.69,111 0 top
R101  30k  [R0805]  75.69,107.7 0 top
R102  100k  [R0805]  75.69,104.39 0 top
R103  30k  [R0805]  70.36,104.39 0 top
R104  100k  [R0805]  75.69,50.04 0 top
R105  30k  [R0805]  75.69,46.74 0 top
R106  100k  [R0805]  75.69,43.43 0 top
R107  30k  [R0805]  70.36,43.43 0 top
R108  2.81k  [R0805]  79.25,30.48 180 top
R109  2.81k  [R0805]  73.91,30.48 180 top
R110  2.81k  [R0805]  77.22,91.69 180 top
R111  2.81k  [R0805]  71.88,91.69 180 top
R112  100k  [R0805]  90.17,59.94 0 top
R113  100k  [R0805]  90.17,56.64 0 top
R114  15k  [R0805]  95.25,62.48 0 top
R115  15k  [R0805]  90.17,53.34 0 top
R116  10k  [R0805]  157.99,49.02 270 top
R117  10k  [R0805]  151.38,49.02 90 top
R118  10k  [R0805]  154.69,49.02 90 top
R119  10k  [R0805]  139.45,24.64 270 top
R120  10k  [R0805]  132.84,24.64 90 top
R121  10k  [R0805]  136.14,24.64 90 top
R122  10k  [R0805]  157.99,24.64 270 top
R123  10k  [R0805]  151.38,24.64 90 top
R124  2.81k  [R0805]  115.82,30.48 180 top
R125  2.81k  [R0805]  110.49,30.48 180 top
R126  2.81k  [R0805]  88.9,30.48 0 top
R127  2.81k  [R0805]  94.23,30.48 0 top
R128  2.81k  [R0805]  115.82,20.57 180 top
R129  2.81k  [R0805]  110.49,20.57 180 top
R130  1k  [R0805]  216.53,208.15 270 top
R131  1k  [R0805]  208.53,208.15 270 top
R132  10k  [R0805]  154.69,24.64 90 top
R133  100k  [R0805]  90.17,120.9 0 top
R134  100k  [R0805]  90.17,117.6 0 top
R135  24k  [R0805]  248.16,138.68 0 top
R136  24k  [R0805]  248.16,135.38 0 top
R137  3.3k  [R0805]  253.49,138.68 0 top
R138  3.3k  [R0805]  248.16,132.08 0 top
R139  24k  [R0805]  248.16,128.78 0 top
R140  3.3k  [R0805]  248.16,125.48 0 top
R141  24k  [R0805]  248.16,122.17 0 top
R142  3.3k  [R0805]  253.49,122.17 0 top
R143  3.3k  [R0805]  267.21,141.22 0 top
R144  24k  [R0805]  272.54,138.68 0 top
R145  24k  [R0805]  272.54,135.38 0 top
R146  3.3k  [R0805]  272.54,132.08 0 top
R147  24k  [R0805]  272.54,128.78 0 top
R148  3.3k  [R0805]  272.54,125.48 0 top
R149  24k  [R0805]  272.54,122.17 0 top
R150  3.3k  [R0805]  267.21,122.17 0 top
R151  30k  [R0805]  95.25,123.44 0 top
R152  30k  [R0805]  90.17,114.3 0 top
R153  100k  [R0805]  114.55,111 0 top
R154  30k  [R0805]  114.55,107.7 0 top
R155  10k  [R0805]  200.03,111.76 180 bottom
R156  100k  [R0805]  114.55,104.39 0 top
R157  1k  [R0805]  205.87,208.15 270 top
R158  30k  [R0805]  109.22,104.39 0 top
R159  1k  [R0805]  194.31,148.34 270 top
R160  1k  [R0805]  202.69,148.34 270 top
R161  1k  [R0805]  198.88,148.34 270 top
R162  1k  [R0805]  206.76,148.34 270 top
R163  120  [R0805]  266.45,69.6 0 top
R164  120  [R0805]  266.45,66.04 0 top
R165  120  [R0805]  266.45,62.48 0 top
R166  120  [R0805]  252.22,104.14 0 top
R167  1k  [R0805]  189.74,148.34 270 top
R168  120  [R0805]  266.45,58.93 0 top
R169  2k  [R0805]  98.04,214.88 90 top
R170  30k  [R0805]  109.22,123.44 0 top
R171  100k  [R0805]  114.55,120.9 0 top
R172  100k  [R0805]  114.55,117.6 0 top
R173  30k  [R0805]  114.55,114.3 0 top
R174  2.81k  [R0805]  115.82,91.69 180 top
R175  2.81k  [R0805]  110.49,91.69 180 top
R176  2.81k  [R0805]  87.63,91.69 0 top
R177  2.81k  [R0805]  94.23,91.69 0 top
R178  2.81k  [R0805]  115.82,82.04 180 top
R179  2.81k  [R0805]  110.49,82.04 180 top
R180  0  [R0805]  140.97,140.46 270 bottom
R181  1k  [R0805]  157.73,114.55 180 bottom
R182  1k  [R0805]  169.93,112.78 90 bottom
R183  1k  [R0805]  157.73,127.76 180 bottom
R184  250  [R0805]  276.48,180.85 90 top
R185  120  [R0805]  165.61,107.19 180 top
R186  120  [R0805]  165.61,103.89 180 top
R187  120  [R0805]  165.61,100.58 180 top
R188  120  [R0805]  162.56,96.01 180 top
R189  120  [R0805]  162.56,91.44 180 top
R190  120  [R0805]  162.56,88.14 180 top
R191  1k  [R0805]  202.82,102.87 0 bottom
R192  27  [R0805]  286,46.23 270 top
R193  27  [R0805]  282.7,46.23 270 top
R194  4.7k  [R0805]  276.35,64.26 270 bottom
R195  10k  [R0805]  276.35,57.66 270 bottom
R196  0  [R0805]  136.27,179.07 0 top
R197  250  [R0805]  258.06,180.85 90 bottom
R198  250  [R0805]  266.45,180.85 90 bottom
R199  250  [R0805]  274.83,180.85 90 bottom
R200  6.8k  [R0805]  166.62,255.52 0 bottom
R201  6.8k  [R0805]  166.62,251.46 0 bottom
R202  6.8k  [R0805]  166.62,243.33 0 bottom
R203  6.8k  [R0805]  166.62,247.4 0 bottom
R204  6.8k  [R0805]  166.62,239.27 0 bottom
R205  6.8k  [R0805]  166.62,235.2 0 bottom
R206  6.8k  [R0805]  166.62,227.08 0 bottom
R207  6.8k  [R0805]  166.62,231.14 0 bottom
R208  6.8k  [R0805]  173.99,141.22 270 bottom
R209  6.8k  [R0805]  178.05,141.22 270 bottom
R210  6.8k  [R0805]  182.12,141.22 270 bottom
R211  6.8k  [R0805]  54.36,40.13 90 bottom
R212  6.8k  [R0805]  60.71,11.43 270 top
R213  6.8k  [R0805]  70.61,10.41 270 bottom
R214  6.8k  [R0805]  59.44,86.61 270 bottom
R215  6.8k  [R0805]  55.63,73.91 0 bottom
R216  6.8k  [R0805]  69.09,73.41 270 bottom
R217  6.8k  [R0805]  95.25,41.66 90 bottom
R218  6.8k  [R0805]  108.71,16 180 bottom
R219  6.8k  [R0805]  104.14,11.43 270 bottom
R220  6.8k  [R0805]  97.54,86.87 270 bottom
R221  6.8k  [R0805]  106.93,75.95 270 bottom
R222  6.8k  [R0805]  115.82,91.44 180 bottom
R223  6.8k  [R0805]  70.87,86.36 270 bottom
R224  6.8k  [R0805]  83.82,29.46 270 top
S1  EVP-BF6C1A000  [EVPBF6C1A000]  248.92,97.54 180 top
S2  200MDP1T2B1M2QEH  [200MDP1T2B1M2QEH]  138.18,146.56 0 top
S3  200MDP1T2B1M2QEH  [200MDP1T2B1M2QEH]  259.08,94.49 0 top
S4  200MSP1T1B1M2QEH  [200MSP1T1B1M2QEH]  125.98,15.49 270 top
S5  200MSP1T1B1M2QEH  [200MSP1T1B1M2QEH]  135.38,15.49 270 top
S6  200MSP1T1B1M2QEH  [200MSP1T1B1M2QEH]  144.78,15.49 270 top
S7  200MSP1T1B1M2QEH  [200MSP1T1B1M2QEH]  154.18,15.49 270 top
S8  200MSP1T1B1M2QEH  [200MSP1T1B1M2QEH]  163.58,15.49 270 top
S9  200MSP1T1B1M2QEH  [200MSP1T1B1M2QEH]  271.53,15.49 270 top
S10  200MSP1T1B1M2QEH  [200MSP1T1B1M2QEH]  262.13,15.49 270 top
S11  200MSP1T1B1M2QEH  [200MSP1T1B1M2QEH]  252.73,15.49 270 top
S12  200MSP1T1B1M2QEH  [200MSP1T1B1M2QEH]  243.33,15.49 270 top
S14  200MSP1T1B1M2QEH  [200MSP1T1B1M2QEH]  242.06,241.05 270 top
S15  200MSP1T1B1M2QEH  [200MSP1T1B1M2QEH]  252.73,241.05 270 top
S16  A6RS-162RS-P  [A6RS162RSP]  163.58,121.16 270 top
SENSOR_SUPPLY  1757255  [SHDR3W120P0X508_1X3_1716X1200X]  7.62,157.48 90 top
U1  5499206-9  [TYCO_5499206-9]  186.82,214.76 180 top
U2  5499206-9  [TYCO_5499206-9]  186.69,160.02 180 top
U4  5499206-8  [TYCO_5499206-8]  227.46,256.54 0 top
U5  5499206-4  [TYCO_5499206-4]  196.98,242.57 180 top
U6  5499206-4  [TYCO_5499206-4]  196.98,227.33 180 top
U7  TL084/SO_OPONLINE  [TL084/SO_OP_LIB]  102.36,86.36 0 top
U10  ISL21080DIH312Z-TK  [SOT23-3]  118.62,144.02 270 top
U13  TL084/SO_OPONLINE  [TL084/SO_OP_LIB]  102.36,25.4 0 top
U$1  TL084/SO_OPONLINE  [TL084/SO_OP_LIB]  63.5,114.3 0 top
U$2  TL084/SO_OPONLINE  [TL084/SO_OP_LIB]  102.36,114.3 0 top
U$3  TL084/SO_OPONLINE  [TL084/SO_OP_LIB]  63.5,53.34 0 top
U$4  TL084/SO_OPONLINE  [TL084/SO_OP_LIB]  63.5,86.36 0 top
U$6  TL084/SO_OPONLINE  [TL084/SO_OP_LIB]  63.5,25.4 0 top
U$8  TL084/SO_OPONLINE  [TL084/SO_OP_LIB]  260.35,132.08 0 top
U$9  TANTALUM_C_1UF_KEMTANTALUM_C_1UF_KEM  [TANTALUM_C_1UF_KEM]  110.49,141.22 270 top
U$10  TANTALUM_C_1UF_KEMTANTALUM_C_1UF_KEM  [TANTALUM_C_1UF_KEM]  100.84,141.22 90 top
U$13  LAUNCHPAD  [LAUNCHPAD28379]  203.45,65.02 0 top
U$15  TL084/SO_OPONLINE  [TL084/SO_OP_LIB]  102.36,53.34 0 top
U$24  AD629_DIFFAONLINE  [AD629_DIFFA_LIB]  28.96,86.36 0 top
U$27  AD629_DIFFAONLINE  [AD629_DIFFA_LIB]  28.96,102.36 0 top
U$28  AD629_DIFFAONLINE  [AD629_DIFFA_LIB]  28.96,34.29 0 top
U$29  AD629_DIFFAONLINE  [AD629_DIFFA_LIB]  28.96,50.8 0 top
U$30  AD629_DIFFAONLINE  [AD629_DIFFA_LIB]  28.96,118.36 0 top
U$31  AD629_DIFFAONLINE  [AD629_DIFFA_LIB]  28.96,66.29 0 top
VPS1  BU-SMA-H  [BU-SMA-H]  7.62,33.02 180 top
VPS2  BU-SMA-H  [BU-SMA-H]  7.62,49.02 180 top
VPS3  BU-SMA-H  [BU-SMA-H]  7.62,65.02 180 top
VR1  PTV09A-4020F-B202  [PTV09A4020FB503]  132.59,115.82 0 top
VR2  PTV09A-4020F-B202  [PTV09A4020FB503]  133.86,55.37 0 top
VR3  PTV09A-4020F-B202  [PTV09A4020FB503]  132.59,91.44 0 top
VR4  PTV09A-4020F-B202  [PTV09A4020FB503]  152.4,55.37 0 top
VR5  PTV09A-4020F-B202  [PTV09A4020FB503]  133.86,30.99 0 top
VR6  PTV09A-4020F-B202  [PTV09A4020FB503]  152.4,30.99 0 top

## Tracks (layer width: path | path; a pad name or v marks a point on that pad's centre or on a via)
+1.5V_LP  (via drill 0.45)
  Top 1.27: v43.69,135.89 v81.28,135.89 83.31,133.86 J9.1 119.38,133.86 v119.63,133.6 | v46.23,46.99 50.1,46.99 R23.1 | R19.1 v47.75,53.34 | R7.1 v44.2,114.3 | R9.1 v44.45,107.7 | v119.63,54.1 118.87,53.34 R65.2 | v44.45,68.07 80.52,68.07 81.79,66.8 81.79,54.86 80.26,53.34 R31.2 | R48.2 v118.87,46.74 | v80.26,114.3 R15.2 | R115.1 86.61,53.34 85.34,54.61 85.34,65.02 87.12,66.8 v119.63,66.8
  Bottom 1.27: 41.91,105.92 41.91,112.52 | 41.91,70.61 41.91,54.86 | 41.91,70.61 41.91,105.92 | 41.91,112.52 41.91,134.11 v43.69,135.89 | 41.91,54.86 41.91,48.26 43.18,46.99 v46.23,46.99 | v47.75,53.34 43.43,53.34 41.91,54.86 | v44.2,114.3 43.69,114.3 41.91,112.52 | v44.45,107.7 43.69,107.7 41.91,105.92 | v118.87,46.74 119.63,47.5 v119.63,54.1 v119.63,66.8 v119.63,133.6 | v44.45,68.07 41.91,70.61 | v81.28,135.89 81.28,115.32 v80.26,114.3
+3.3V_DSP  (via drill 0.45)
  Top 1.27: S2.3 140.46,153.92 v171.96,153.92 | v189.99,57.15 191.26,58.42 v191.26,118.87 | J12.1 178.31,62.48 v183.64,57.15
  Bottom 1.27: U$13.P$41 180.59,48.96 C23.1 180.53,54.04 v183.64,57.15 v189.99,57.15 | v171.96,153.92 179.32,153.92 185.17,148.08 185.17,144.27 192.28,137.16 192.28,119.89 v191.26,118.87 184.72,118.87 C24.1 183.45,118.94 180.59,116.08 U$13.P$1
+3.3V_LM  (via drill 0.3, 0.45, 0.6)
  Top 0.305: IC17.14 252.56,85.01 252.48,85.09 | 280.16,85.34 280.5,85.01 IC19.14 282.37,85.01 284.48,87.12 286.19,87.12 | 280.16,87.31 C39.1 | 286.19,87.12 287.53,87.12 287.78,86.87 287.78,80.52 287.53,80.26 286.32,80.26 R88.2 | 286.19,87.12 R81.2
  Top 0.61: R162.2 206.5,147.32 | IC21.3 255.02,49.4 252.48,51.94 IC20.16 248.03,51.94 245.49,49.4 IC20.3 IC20.4 | IC21.3 IC21.4 | IC21.3 264.54,49.4 267.08,51.94 IC21.16 271.65,51.94 272.29,52.58 272.29,57.66 271.02,58.93 R168.2 R165.2 R164.2 R163.2 267.4,71.05 268.73,72.39 279.15,72.39 v284.23,77.47 284.23,80.01 284.55,80.33 R88.2 | 241.62,79.44 R77.1 R76.1 241.55,85.16 241.55,86.61 242.45,87.51 252.16,87.51 | 241.62,79.44 v243.59,77.47 | 252.48,85.09 252.16,85.41 252.16,87.51 | R86.1 260.1,85.09 | 260.1,85.09 R87.2 | 260.1,85.09 260.03,85.02 R80.2 | v268.22,77.47 268.29,77.54 R82.2 R87.2 | 280.16,85.34 279.91,85.6 279.91,87.44 C39.1 | v179.83,138.68 v175.77,138.68 v171.7,138.68 171.2,138.68 170.43,139.45 170.43,141.73 172.97,144.27 J15.2 | D27.2 88.46,25.59 89.92,24.13 v93.22,24.13 | v74.93,11.43 65.94,11.43 D15.2 | v82.3,79.76 v91.69,79.76 | v239.27,79.5 241.55,79.5 241.62,79.44 | R87.2 268.29,86.55 v267.72,87.12 | 252.16,87.51 C26.1 | S3.3 260.86,99.57 261.87,98.55 261.87,94.74 262.13,94.49 S3.4
  Top 0.813: 120.14,226.82 120.14,227.08 | 120.72,227.65 120.14,227.08 | 119.38,226.06 IC3.TAB 119.89,226.82 120.14,227.08 | R84.2 122.36,227.77 121.92,227.33 120.9,227.33 120.65,227.08 120.14,227.08
  Top 1.27: C6.1 105.59,227.4 106.93,226.06 IC3.2 119.38,226.06 | IC3.TAB 127.25,226.06 129.54,223.77 v129.54,220.98 155.19,220.98 157.99,223.77 v157.99,224.79 v157.99,228.85 v157.99,232.92 v157.99,236.98 v157.99,241.05 v157.99,245.11 v157.99,249.17 v157.99,253.24 | v132.33,171.2 v182.63,171.2 203.71,171.2 204.47,170.43 204.47,167.96 C41.1 204.54,162.63 U2.25 | 203.45,147.39 206.5,147.32 276.86,147.32 279.4,144.78 279.4,106.68 | R161.2 202.88,147.39 202.95,147.32 203.39,147.32 203.45,147.39 | 203.45,147.39 R160.2 R159.2 R167.2 187.52,147.39 v187.45,147.32 186.44,148.34 173.99,148.34 172.97,147.32 J15.2 | 279.4,106.68 276.86,104.14 260.6,104.14 | 260.6,104.14 259.08,102.62 S3.3 | 260.6,104.14 R166.2 | S2.2 130.3,149.1 v129.54,149.86 122.17,149.86 120.14,147.83 100.08,147.83 v91.69,139.45 v59.94,139.45 | 279.4,106.68 285.75,106.68 J17.1
  Bottom 0.61: v284.23,77.47 v268.22,77.47 v243.59,77.47 | D3.2 158.16,253.41 v157.99,253.24 | D4.2 158.16,249.34 v157.99,249.17 | D6.2 158.16,245.28 v157.99,245.11 | D5.2 158.16,241.22 v157.99,241.05 | D7.2 158.16,237.15 v157.99,236.98 | D8.2 158.16,233.09 v157.99,232.92 | D10.2 158.16,229.02 v157.99,228.85 | D9.2 158.16,224.96 v157.99,224.79 | D11.2 171.62,138.6 v171.7,138.68 | D12.2 175.68,138.6 v175.77,138.68 | D13.2 179.75,138.6 v179.83,138.68 | D22.2 101.7,7.62 98.55,7.62 94.74,11.43 93.22,11.43 | D25.2 113.47,88.58 113.03,88.14 113.03,85.85 114.81,84.07 114.81,71.37 114.05,70.61 | 114.05,70.61 114.05,12.95 113.28,12.19 111.91,12.19 D21.2 | 114.05,70.61 110.74,70.61 109.79,71.56 D24.2 98.89,72.81 96.52,75.18 93.17,75.18 93.07,75.08 | D14.2 52.24,65.7 53.59,67.06 53.59,68.43 D18.2 52.66,68.5 52.07,69.09 52.07,81.79 53.09,82.8 57.25,82.8 D17.2 57.32,136.82 v59.94,139.45 | D23.2 91.76,82.99 91.69,83.06 | 93.22,11.43 v93.22,24.13 93.22,41.15 90.93,43.43 90.93,46.48 91.95,47.5 93.07,47.5 | 93.07,47.5 93.07,75.08 | 93.07,75.08 91.69,76.45 v91.69,79.76 | 93.22,11.43 91.52,9.74 D16.2 75.37,10.99 v74.93,11.43 | D26.2 81.47,80.58 v82.3,79.76 82.3,74.42 79.25,71.37 74.32,71.37 D19.2 | 93.07,47.5 D20.2 | v239.27,79.5 238.51,80.26 IC28.5 | S2.2 139.7,149.1 140.97,147.83 R180.1 | v267.72,87.12 267.72,92.96 266.19,94.49 S3.4
  Bottom 1.27: v129.54,220.98 129.54,173.48 | 129.54,173.48 v129.54,149.86 | 129.54,173.48 v132.33,171.2 | v182.63,171.2 182.63,156.46 187.45,151.64 v187.45,147.32 198.63,136.14 198.63,112.21 R155.1 | v91.69,139.45 91.69,83.06 v91.69,79.76
+3.3V_MOS  (via drill 0.45)
  Top 0.61: v205.23,132.33 156.46,132.33 152.65,136.14 J3.2 | v205.49,16 v179.32,16
  Bottom 0.305: IC18.2 194.57,87.38 194.06,86.87 C71.1
  Bottom 0.61: S9.3 S10.3 S11.3 S12.3 211.07,10.41 v205.49,16 205.49,83.57 | v179.32,16 175.26,16 169.67,10.41 S8.3 S7.3 S6.3 S5.3 S4.3 | C72.1 C71.1 205.42,83.5 205.49,83.57 | 205.49,83.57 205.49,132.08 v205.23,132.33 | R180.2 140.97,137.41 142.24,136.14 J3.2
+5V_DSP  (via drill 0.45)
  Top 1.27: S2.4 150.62,146.56 162.31,134.87 v194.82,134.87 | v191.77,54.61 193.8,56.64 v193.8,116.59 | J12.2 177.04,59.94 182.37,54.61 v184.66,54.61
  Bottom 1.27: U$13.P$21 183.13,112.46 C30.1 183.13,112.59 183.13,114.81 184.91,116.59 v193.8,116.59 195.83,118.62 195.83,133.86 v194.82,134.87 | U$13.P$61 183.13,48.96 C25.1 183.2,53.15 v184.66,54.61 v191.77,54.61
+5V_TLS  (via drill 0.45)
  Top 0.406: 153.01,120.55 153.16,120.4 | IC1.2 153.01,120.55 | IC1.13 151.71,119.25 153.01,120.55 | J10.1 C109.1 C92.1 281.18,37.34 279.4,39.12 279.4,41.08 C91.1 279.4,41.21 v279.4,44.45
  Top 0.61: IC2.3 104.65,143.3 104.65,144.27 105.16,144.78 106.17,144.78 106.61,144.34 IC2.1 110.23,143.24 U$9.P 114.01,142.97 C73.1 114.23,142.94 115.06,143.76 117.4,143.76 U10.1 123.38,143.7 v124.46,144.78 | 153.16,120.4 153.67,119.89 154.69,119.89 154.69,120.14 155.7,121.16 S16.C1
  Top 0.813: 118.62,201.75 115.9,201.75 5V_VR.5 | 118.62,201.75 C22.1 | 118.62,201.75 117.86,202.51 117.86,214.88 118.62,215.65 120.46,215.65 R83.2
  Top 1.27: C22.1 123.37,201.75 v124.46,200.66 | v124.46,144.78 125.98,143.26 138.68,143.26 140.72,145.29 140.72,148.34 141.48,149.1 S2.5 166.12,149.1 v166.88,148.34 169.42,148.34 170.43,147.32 J15.1 | S16.C2 v166.88,121.16 S16.C1
  Bottom 0.406: IC23.12 280.1,45.15 v279.4,44.45
  Bottom 1.27: v124.46,144.78 v124.46,200.66 | v166.88,148.34 v166.88,121.16 166.88,94.74 J8.6 169.42,93.98 174.24,89.15 174.24,74.42 183.13,65.53 190.25,65.53 198.12,57.66 198.12,17.27 211.07,4.32 274.07,4.32 276.61,6.86 276.61,33.27 277.37,34.04 J10.1
+15V_POWER  (via drill 0.45, 0.6)
  Top 0.61: C103.2 31.75,123.19 33.27,121.67 33.27,119.66 32.61,119 | U$30.7 32.61,119 | C95.2 30.23,91.44 32.51,91.44 33.27,90.68 33.27,87.63 32.64,87 U$24.7 | 31.75,107.19 33.02,105.92 33.02,103.89 32.13,103 U$27.7 | C101.2 30.48,71.12 32.26,71.12 33.53,69.85 33.53,67.82 32.64,66.93 U$31.7 | C105.2 32.51,55.63 33.27,54.86 33.27,52.32 32.26,51.31 31.55,51.31 U$29.7 | C99.2 32.26,39.12 33.78,37.59 33.78,36.07 32.64,34.92 U$28.7 | U$1.4 62.23,114.3 63.25,115.32 63.25,119.38 62.8,119.82 C1.2 62.8,125.41 v62.79,125.42 | U$4.4 62.23,86.36 63.25,87.38 63.25,92.46 62.8,92.9 C75.1 62.8,97.22 62.23,97.79 36.32,97.79 35.05,96.52 v35.05,92.2 | v34.54,119 32.61,119 | v62.74,130.3 64.26,131.83 | U$3.4 62.23,53.34 63.25,54.36 63.25,57.91 62.55,58.61 C3.2 60.71,62.48 60.2,62.99 60.2,64.77 59.69,65.28 v38.1,65.28 | U$6.4 62.48,25.4 63.25,26.16 63.25,29.46 62.8,29.91 C79.1 62.8,37.27 62.23,37.85 48.26,37.85 46.23,39.88 v35.05,39.88 | U$15.4 101.09,53.34 102.36,54.61 102.36,59.18 101.35,60.2 101.35,62.42 C12.2 101.41,63.43 100.84,64.01 v91.19,64.01 | U13.4 101.35,25.4 102.36,26.42 102.36,29.72 101.41,30.67 C20.1 101.41,38.03 100.33,39.12 v89.41,39.12 | C28.2 259.4,137.09 259.84,136.65 259.84,132.59 259.33,132.08 U$8.4 | U$2.4 101.35,114.3 102.11,115.06 102.11,119.38 101.67,119.82 C61.2 99.82,123.44 v99.31,123.95 | U7.4 101.35,86.36 102.11,87.12 102.11,91.95 101.41,92.64 C69.1 101.41,96.2 100.33,97.28 v88.39,97.28
  Top 1.016: C97.2 31.75,107.19 34.29,107.19 v35.05,107.95 | v35.05,92.2 34.29,91.44 30.23,91.44 | v35.05,71.88 34.29,71.12 30.48,71.12 | v35.05,56.64 34.04,55.63 C105.2 | v35.05,39.88 34.29,39.12 C99.2
  Top 1.27: IC3.3 106.35,223.52 C5.1 105.66,222.68 105.66,213.61 103.12,211.07 v103.12,203.2 | 5V_VR.2 5V_VR.1 109.88,202.85 108.71,201.68 105.22,201.68 | 105.22,201.68 C7.2 | v35.31,130.81 36.32,131.83 64.26,131.83 v88.39,131.83 v100.08,131.83 125.48,131.83 126.75,130.56 238.25,130.56 239.78,132.08 239.78,140.21 240.79,141.22 C28.2 259.33,141.29 | C33.2 90.95,195.09 24/15_CONV.P$3 91.44,201.17 92.9,202.63 R32.2 102.55,202.63 v103.12,203.2 | v103.12,203.2 103.12,202.95 104.39,201.68 105.22,201.68
  Bottom 0.61: v34.54,119 34.67,119 35.05,118.62 | v62.79,125.42 62.79,130.25 v62.74,130.3 | 35.56,65.28 35.05,64.77 | v38.1,65.28 35.81,65.28 35.05,64.52 | v99.31,123.95 99.31,131.06 v100.08,131.83
  Bottom 1.27: 35.05,118.62 v35.05,107.95 v35.05,92.2 v35.05,71.88 35.05,64.77 35.05,64.52 v35.05,56.64 v35.05,39.88 | v35.31,130.81 35.31,119.63 34.67,119 | v103.12,203.2 101.85,201.93 101.85,133.6 v100.08,131.83 | v88.39,131.83 v88.39,97.28 88.39,66.8 v91.19,64.01 88.39,61.21 88.39,39.62 88.9,39.12 v89.41,39.12
+15V_SENSOR
  Top 1.27: 24/15_CONV_SENSOR.P$3 16.51,175.26 13.97,172.72 C36.2 10.16,168.67 | 10.16,168.67 9.92,168.67 | 10.16,168.67 8.65,168.67 SENSOR_SUPPLY.3
+24V_POWER  (via drill 0.45)
  Top 0.61: IC16.6 168.4,201.36 C47.1 | IC15.6 176.78,201.51 C55.1 | IC14.6 184.91,201.36 C54.1 | IC13.6 192.79,201.61 C53.1 | IC12.6 201.42,201.36 C52.1 201.74,206.51 C31.1 204.22,207.2 | IC10.6 217.93,201.36 C51.1 | IC11.6 209.8,201.36 C50.1 | IC9.6 226.06,201.36 C49.1 | IC8.6 234.44,201.36 C48.1 | IC7.6 242.49,201.53 C46.1 242.82,201.74 242.82,209.55 247.4,214.12 247.4,218.44 241.3,224.54 241.3,235.2 S14.3 S15.3 252.98,235.97 | IC6.6 251.38,201.28 C45.1 | IC5.6 259.74,201.25 C44.1 260.1,201.74 | IC4.6 268.12,201.51 C43.1 | U1.25 205.87,216.03 205.87,213.23 204.22,211.58 204.22,207.2 | U4.1 U4.3 U4.5 | 204.22,207.2 R157.2 R131.2 R27.2 R28.2 R130.2 | C85.1 276.48,201.48 IC22.6
  Top 0.813: IC4.6 268.12,191.92 267.21,191.01 | IC5.6 259.74,192.68 258.06,191.01 | IC6.6 251.38,192.46 249.94,191.01 | IC7.6 242.49,192.2 241.3,191.01 | IC8.6 234.44,192.28 233.17,191.01 | IC9.6 226.06,192.02 225.04,191.01 | IC10.6 217.93,192.79 216.41,191.26 216.41,191.01 | IC11.6 209.8,192.02 208.79,191.01 | IC12.6 201.42,192.53 199.9,191.01 | IC13.6 192.79,192.53 191.26,191.01 | IC14.6 184.91,192.28 183.64,191.01 | IC15.6 176.78,192.02 175.77,191.01 | IC16.6 168.4,192.53 166.88,191.01 | IC22.6 276.48,191.9 275.59,191.01
  Top 1.27: 275.59,191.01 v273.56,191.01 267.21,191.01 v265.18,191.01 258.06,191.01 v256.92,191.01 249.94,191.01 v248.16,191.01 241.3,191.01 233.17,191.01 225.04,191.01 216.41,191.01 208.79,191.01 199.9,191.01 191.26,191.01 183.64,191.01 175.77,191.01 166.88,191.01 128.52,191.01 127,189.48 127,175.26 124.39,172.65 R46.2 89.98,172.65 24/24_CONV.P$9 89.41,175.01 90.93,176.53 90.93,178.8 C32.2
  Bottom 0.61: U1.25 201.17,220.73 201.17,222.23 D2.2 201.15,223.5 203.33,225.68 203.33,233.87 C42.1 203.39,237.66 D1.2 203.31,248.62 C27.1 203.27,249.87 202.95,250.19 195.71,250.19 U4.5 | C110.1 249.43,201.61 IC24.6 | C111.1 258.19,201.48 IC25.6 | C112.1 266.45,201.61 IC26.6 | C113.1 274.83,201.61 IC27.6
  Bottom 0.813: IC27.6 274.83,192.28 v273.56,191.01 | IC26.6 266.45,192.28 v265.18,191.01 | IC25.6 258.19,192.28 v256.92,191.01 | IC24.6 249.43,192.28 v248.16,191.01
+24V_TBA
  Top 1.27: FUSE2.1 FUSE1.1 | FUSE2.1 FUSE3.1 | 24V_SUPPLY.2 FUSE2.1
-15V_POWER  (via drill 0.3, 0.45)
  Top 0.61: C104.2 26.49,115.05 U$30.4 | C100.2 27.43,29.46 26.42,30.48 26.42,32.31 U$28.4 | U$31.4 26.49,62.98 27.75,61.72 | U$29.4 26.49,47.49 27.75,46.23 | U$27.4 26.49,98.54 27.75,97.28 | U$24.4 26.49,82.47 27.43,81.53 | U$1.11 64.77,114.3 64.26,113.79 64.26,108.97 64.7,108.52 C2.2 66.29,104.39 69.6,101.09 v84.58,101.09 87.95,104.46 101.6,104.46 | U$4.11 65.02,86.36 64.26,85.6 64.26,81.79 64.7,81.35 C76.1 64.7,76.77 66.55,74.93 84.07,74.93 v84.58,75.44 87.63,78.49 C70.1 101.85,78.67 101.85,80.52 102.36,81.03 102.36,85.09 103.63,86.36 U7.11 | U$3.11 65.28,53.34 64.01,52.07 64.01,48.77 64.45,48.33 C4.2 64.45,41.72 66.04,40.13 v84.58,40.13 87.88,43.43 C13.2 101.85,43.62 101.85,46.23 102.36,46.74 102.36,51.56 104.14,53.34 U$15.11 | U13.11 103.63,25.4 102.36,24.13 102.36,19.81 101.85,19.3 101.85,17.71 C21.1 99.57,17.53 96.77,14.73 v91.19,14.73 | C29.2 261.55,127.07 261.11,127.51 261.11,131.57 261.62,132.08 U$8.11 | U$6.11 64.77,25.4 64.01,24.64 64.01,19.81 64.77,19.05 64.77,17.34 C80.1 64.7,15.05 66.29,13.46 82.3,13.46 v84.58,15.75 | U$2.11 103.63,114.3 102.36,113.03 102.36,107.95 101.6,107.19 101.6,104.46 | 101.6,104.46 C62.2
  Top 1.016: v23.62,114.81 23.62,114.55 24.89,113.28 27.75,113.28 C104.2 | v23.62,98.04 24.38,97.28 27.75,97.28 C98.2 | v23.62,82.55 24.64,81.53 27.43,81.53 C96.2 | v23.62,62.48 24.38,61.72 27.75,61.72 C102.2 | v23.62,46.99 24.38,46.23 27.75,46.23 C106.2
  Top 1.27: v23.62,30.48 24.64,29.46 27.43,29.46 | LED_-15V.1 92.39,208.35 91.44,209.3 24/15_CONV.P$5 | C34.1 90.95,221.47 91.44,220.98 24/15_CONV.P$5 | 83.31,144.27 83.31,207.77 24/15_CONV.P$5 | v84.58,129.03 85.34,128.27 238.25,128.27 239.78,126.75 239.78,117.35 241.05,116.08 260.86,116.08 261.62,116.84 261.62,122.11 C29.2 | 83.31,144.27 v84.58,143 | 83.31,144.27 29.97,144.27 v23.62,137.92
  Bottom 0.61: v91.19,14.73 85.6,14.73 v84.58,15.75
  Bottom 1.27: v23.62,137.92 v23.62,114.81 v23.62,98.04 v23.62,82.55 v23.62,62.48 v23.62,46.99 v23.62,30.48 | v84.58,143 v84.58,129.03 v84.58,101.09 v84.58,75.44 v84.58,40.13 v84.58,15.75
-15V_SENSOR
  Top 1.27: 24/15_CONV_SENSOR.P$5 15,154.94 C37.1 11.18,153.91 10.16,154.94 SENSOR_SUPPLY.1
ACC_IREF
  Top 0.406: IC1.4 151.71,124.9 | 142.05,110.49 C40.1
  Top 0.61: U$13.P$27 181.86,94.23 179.07,94.23 175.01,98.3 146.56,98.3 145.8,99.06 145.8,108.46 143.76,110.49 142.05,110.49 | 151.71,124.9 150.62,125.98 144.27,125.98 143,124.71 143,112.78 141.99,111.76 C40.1 141.92,110.49 140.72,110.49 140.21,109.98 140.21,109.22 139.51,108.52 R92.1
ACC_KP  (via drill 0.45)
  Top 0.406: IC1.5 151.06,119.82 151,119.76
  Top 0.61: v129.54,53.59 C56.1 129.61,50.04 130.81,50.04 131.32,49.53 131.32,48.51 131.76,48.07 R95.1 | 151,119.76 150.62,119.38 148.34,119.38 146.81,117.86 146.81,114.55 152.4,108.97 156.21,108.97 v156.97,108.2 | v130.81,81.28 144.53,81.28 145.29,80.52 v156.97,80.52 166.88,80.52 J8.1
  Bottom 0.61: v129.54,53.59 127.76,55.37 127.76,78.23 v130.81,81.28 | v156.97,108.2 v156.97,80.52
ADC/DAC1  (via drill 0.45)
  Top 0.61: U$13.P$30 184.4,85.34 185.17,84.58 185.17,79.25 181.1,74.93 v162.56,74.93 138.18,74.93 J13.1
  Bottom 0.61: v162.56,74.93 162.56,150.62 150.88,162.31 150.88,224.28 157.73,231.14 161.37,231.14 | R207.2 161.37,231.14 | 161.37,231.14 D10.3
ADC/DAC2
  Bottom 0.61: J14.1 113.54,8.64 174.5,8.64 183.13,17.27 U$13.P$70 181.86,23.11 177.29,23.11 174.24,26.16 174.24,64.26 170.18,68.33 163.58,68.33 160.78,71.12 160.78,150.62 149.1,162.31 149.1,226.57 157.73,235.2 161.37,235.2 | R205.2 161.37,235.2 | 161.37,235.2 D8.3
BIDIRECTIONAL
  Bottom 0.61: U4.9 198.25,255.27 198.25,258.19 199.9,259.84 228.85,259.84 231.65,257.05 231.65,248.92 S14.2
CLEAR_FAULT_3.3V  (via drill 0.45)
  Top 0.61: v203.2,157.99 203.2,160.78 203.71,161.29 205.74,161.29 U2.23 208.53,164.08 208.53,168.91 204.47,172.97 173.48,172.97 170.43,176.02 R45.1 | v211.84,155.45 211.84,154.18 v209.04,151.38 207.77,151.38 206.76,150.37 R162.1 238.06,149.29 v238.25,149.1 | S1.A1 244.89,99.54 244.86,99.57 244.86,103.95 LED10.1 244.67,110.17 243.08,111.76 v238.51,111.76
  Bottom 0.61: v203.2,157.99 203.96,157.23 210.06,157.23 v211.84,155.45 | v209.04,151.38 209.04,143.76 201.17,135.89 201.17,111.95 R155.2 201.17,111.57 202.38,111.57 203.2,110.74 Q3.3 | v238.25,149.1 238.25,112.01 v238.51,111.76
CLEAR_FAULT_24V  (via drill 0.45)
  Top 0.61: IC16.5 v169.67,198.63 | U1.23 208.41,216.03 208.41,209.23 R131.1
  Bottom 0.61: U1.23 205.87,216.03 205.87,213.74 202.69,210.57 173.99,210.57 169.67,206.25 v169.67,198.63
EN_3.3V  (via drill 0.45)
  Top 0.305: IC17.4 245.87,83.06 244.6,81.79 R77.2 R76.2 244.03,85.6 245.87,85.6 246.46,85.01 IC17.1 251.03,85.01 251.71,84.33 253.61,84.33 | 253.61,84.33 IC17.13 | 253.61,84.33 254.51,84.33 255.27,85.09 R86.2 | IC17.10 256.43,82.41 257.05,81.79 R80.1
  Top 0.61: R80.1 R86.2 258.06,85.41 v258.06,87.12
  Bottom 0.61: v258.06,87.12 258.06,89.15 256.54,90.68 256.54,95.5 258.06,97.03 S3.2
EN_24V  (via drill 0.6)
  Top 0.305: 281.29,84.33 279.4,84.33 278.72,85.01 IC19.1 275.36,85.09 273.81,85.09 273.3,85.6 272.03,85.6 271.53,85.09 R87.1 | 281.29,84.33 IC19.13 | IC19.4 271.53,83.06 271.27,82.8 271.27,82.04 271.02,81.79 R82.1 | 281.29,84.33 282.7,84.33 283.46,85.09 286.19,85.09 R81.1 R88.1 286.08,82.41 IC19.10
  Top 0.61: R82.1 R87.1 270.26,85.41 v270.26,87.12
  Bottom 0.61: v270.26,87.12 270.26,94.23 267.46,97.03 S3.5
EXTRA_KNOB  (via drill 0.45)
  Top 0.406: IC1.11 150.41,117.81 150.37,117.86
  Top 0.61: v148.08,29.21 C60.1 148.15,25.65 149.1,25.65 149.86,24.89 149.86,24.13 150.3,23.69 R123.1 | 150.37,117.86 150.11,118.11 148.59,118.11 148.08,117.6 148.08,115.06 152.91,110.24 157.48,110.24 v158.24,109.47 | v144.78,85.85 145.41,86.49 v158.24,86.49 165.23,86.49 J8.4